# EAGLE schematic cosv-carrier-teensy40_2 (EAGLE 9.6.2)
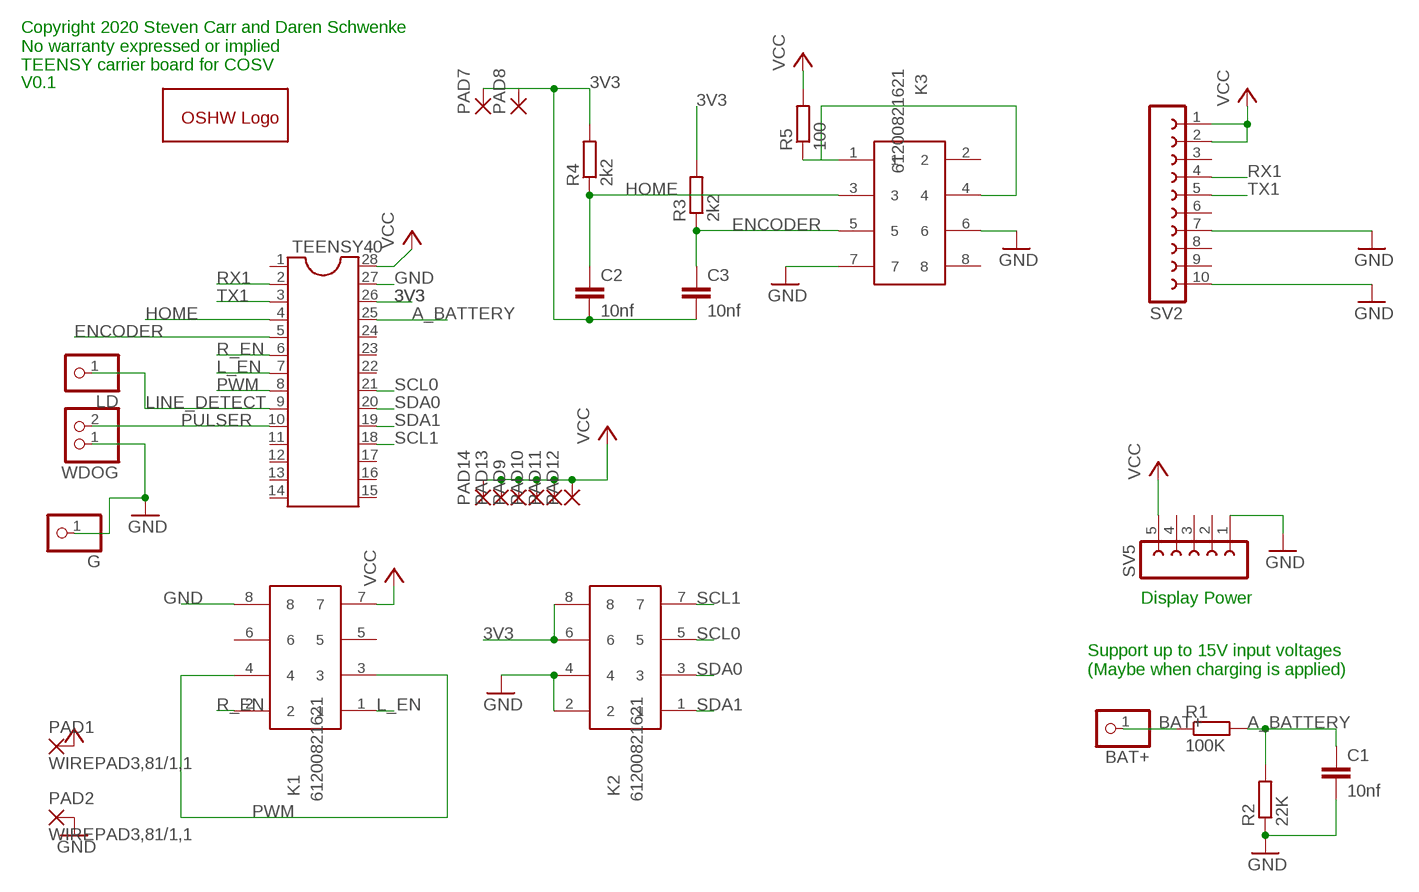
[diagram p0: schematic, sheet 1]

## Parts
BAT+  PINHD-1X01_2.54-S  [1X01-S]
C1  10nf  C-EUC1206  [C1206]
C2  10nf  C-EUC1206  [C1206]
C3  10nf  C-EUC1206  [C1206]
G  PINHD-1X01_2.54-S  [1X01-S]
GOLD_ORB_SM1  OSHWLOGOLOGO8MM  [OSHW_8MM]
K1  61200821621  [61200821621]
K2  61200821621  [61200821621]
K3  61200821621  [61200821621]
LD  PINHD-1X01_2.54-S  [1X01-S]
PAD1  WIREPAD3,81/1,1  [3,81/1,1]
PAD2  WIREPAD3,81/1,1  [3,81/1,1]
PAD7  1,6/0,9  [1,6/0,9]
PAD8  1,6/0,9  [1,6/0,9]
PAD9  1,6/0,9  [1,6/0,9]
PAD10  1,6/0,9  [1,6/0,9]
PAD11  1,6/0,9  [1,6/0,9]
PAD12  1,6/0,9  [1,6/0,9]
PAD13  1,6/0,9  [1,6/0,9]
PAD14  1,6/0,9  [1,6/0,9]
R1  100K  R-EU_R1206  [R1206]
R2  22K  R-EU_R1206  [R1206]
R3  2k2  R-EU_R1206  [R1206]
R4  2k2  R-EU_R1206  [R1206]
R5  100  R-EU_R1206  [R1206]
SV2  FE10-1  [FE10]
SV5  FE05W  [FE05W]
TEENSY40  DIL28  [DIL28-6]
WDOG  PINHD-1X2  [1X02]

## Nets
3V3: C2.2 C3.2 K2.6 K2.8 PAD7.1(P) PAD8.1(P) R3.2 R4.2 TEENSY40.26
A_BATTERY: C1.1 R1.2 R2.2 TEENSY40.25
BAT+: BAT+.1 R1.1
ENCODER: C3.1 K3.5 R3.1 TEENSY40.5
GND: C1.2 G.1 K1.8 K2.2 K2.4 K3.6 K3.7 PAD2.1(P) R2.1 SV2.7 SV2.10 SV5.1 TEENSY40.27 WDOG.1
HOME: C2.1 K3.3 R4.1 TEENSY40.4
L_EN: K1.1 TEENSY40.7
LED: K3.1 K3.4 R5.1
LINE_DETECT: LD.1 TEENSY40.9
PULSER: TEENSY40.10 WDOG.2
PWM: K1.3 K1.4 TEENSY40.8
R_EN: K1.2 TEENSY40.6
RX1: SV2.4 TEENSY40.2
SCL0: K2.5 TEENSY40.21
SCL1: K2.7 TEENSY40.18
SDA0: K2.3 TEENSY40.20
SDA1: K2.1 TEENSY40.19
TX1: SV2.5 TEENSY40.3
VCC: K1.7 PAD1.1(P) PAD9.1(P) PAD10.1(P) PAD11.1(P) PAD12.1(P) PAD13.1(P) PAD14.1(P) R5.2 SV2.1 SV2.2 SV5.5 TEENSY40.28
Unconnected: K1.5 K1.6 K3.2 K3.8 SV2.3 SV2.6 SV2.8 SV2.9 SV5.2 SV5.3 SV5.4 TEENSY40.1 TEENSY40.11 TEENSY40.12 TEENSY40.13 TEENSY40.14 TEENSY40.15 TEENSY40.16 TEENSY40.17 TEENSY40.22 TEENSY40.23 TEENSY40.24

## Notes on the sheet
- Copyright 2020 Steven Carr and Daren Schwenke
  No warranty expressed or implied
  TEENSY carrier board for COSV
- V0.1
- Display Power
- Support up to 15V input voltages
  (Maybe when charging is applied)

## Library data of the parts
BAT+ G LD = pinhead-2:PINHD-1X01: PIN HEADER
C1-C3 = rcl:C-EU: CAPACITOR, European symbol
GOLD_ORB_SM1 = oshw:OSHWLOGO: The OSHW logo for PCB layout
K1-K3 = Wuerth_Elektronik_eiCan_05_Box_Header_IDC_Connectors_1_2:61200821621: WR-BHD 2.54mm Male Box Header, 8 Pins
PAD1 PAD2 = wirepad:WIREPAD: Wire PAD connect wire on PCB
PAD7-PAD14 = wirepad:1,6/0,9: THROUGH-HOLE PAD
R1-R5 = resistor:R-EU_: RESISTOR, European symbol
SV2 = con-lsta:FE10-1: FEMALE HEADER; OC_FARNELL: unknown; OC_NEWARK: unknown
SV5 = con-lsta:FE05W: FEMALE HEADER; OC_FARNELL: unknown; OC_NEWARK: unknown
TEENSY40 = ic-package:DIL28: Dual In Line
WDOG = pinhead:PINHD-1X2: PIN HEADER